# Altium project ThunderGuppy_3.0.PrjPcb (part 1 of 2)
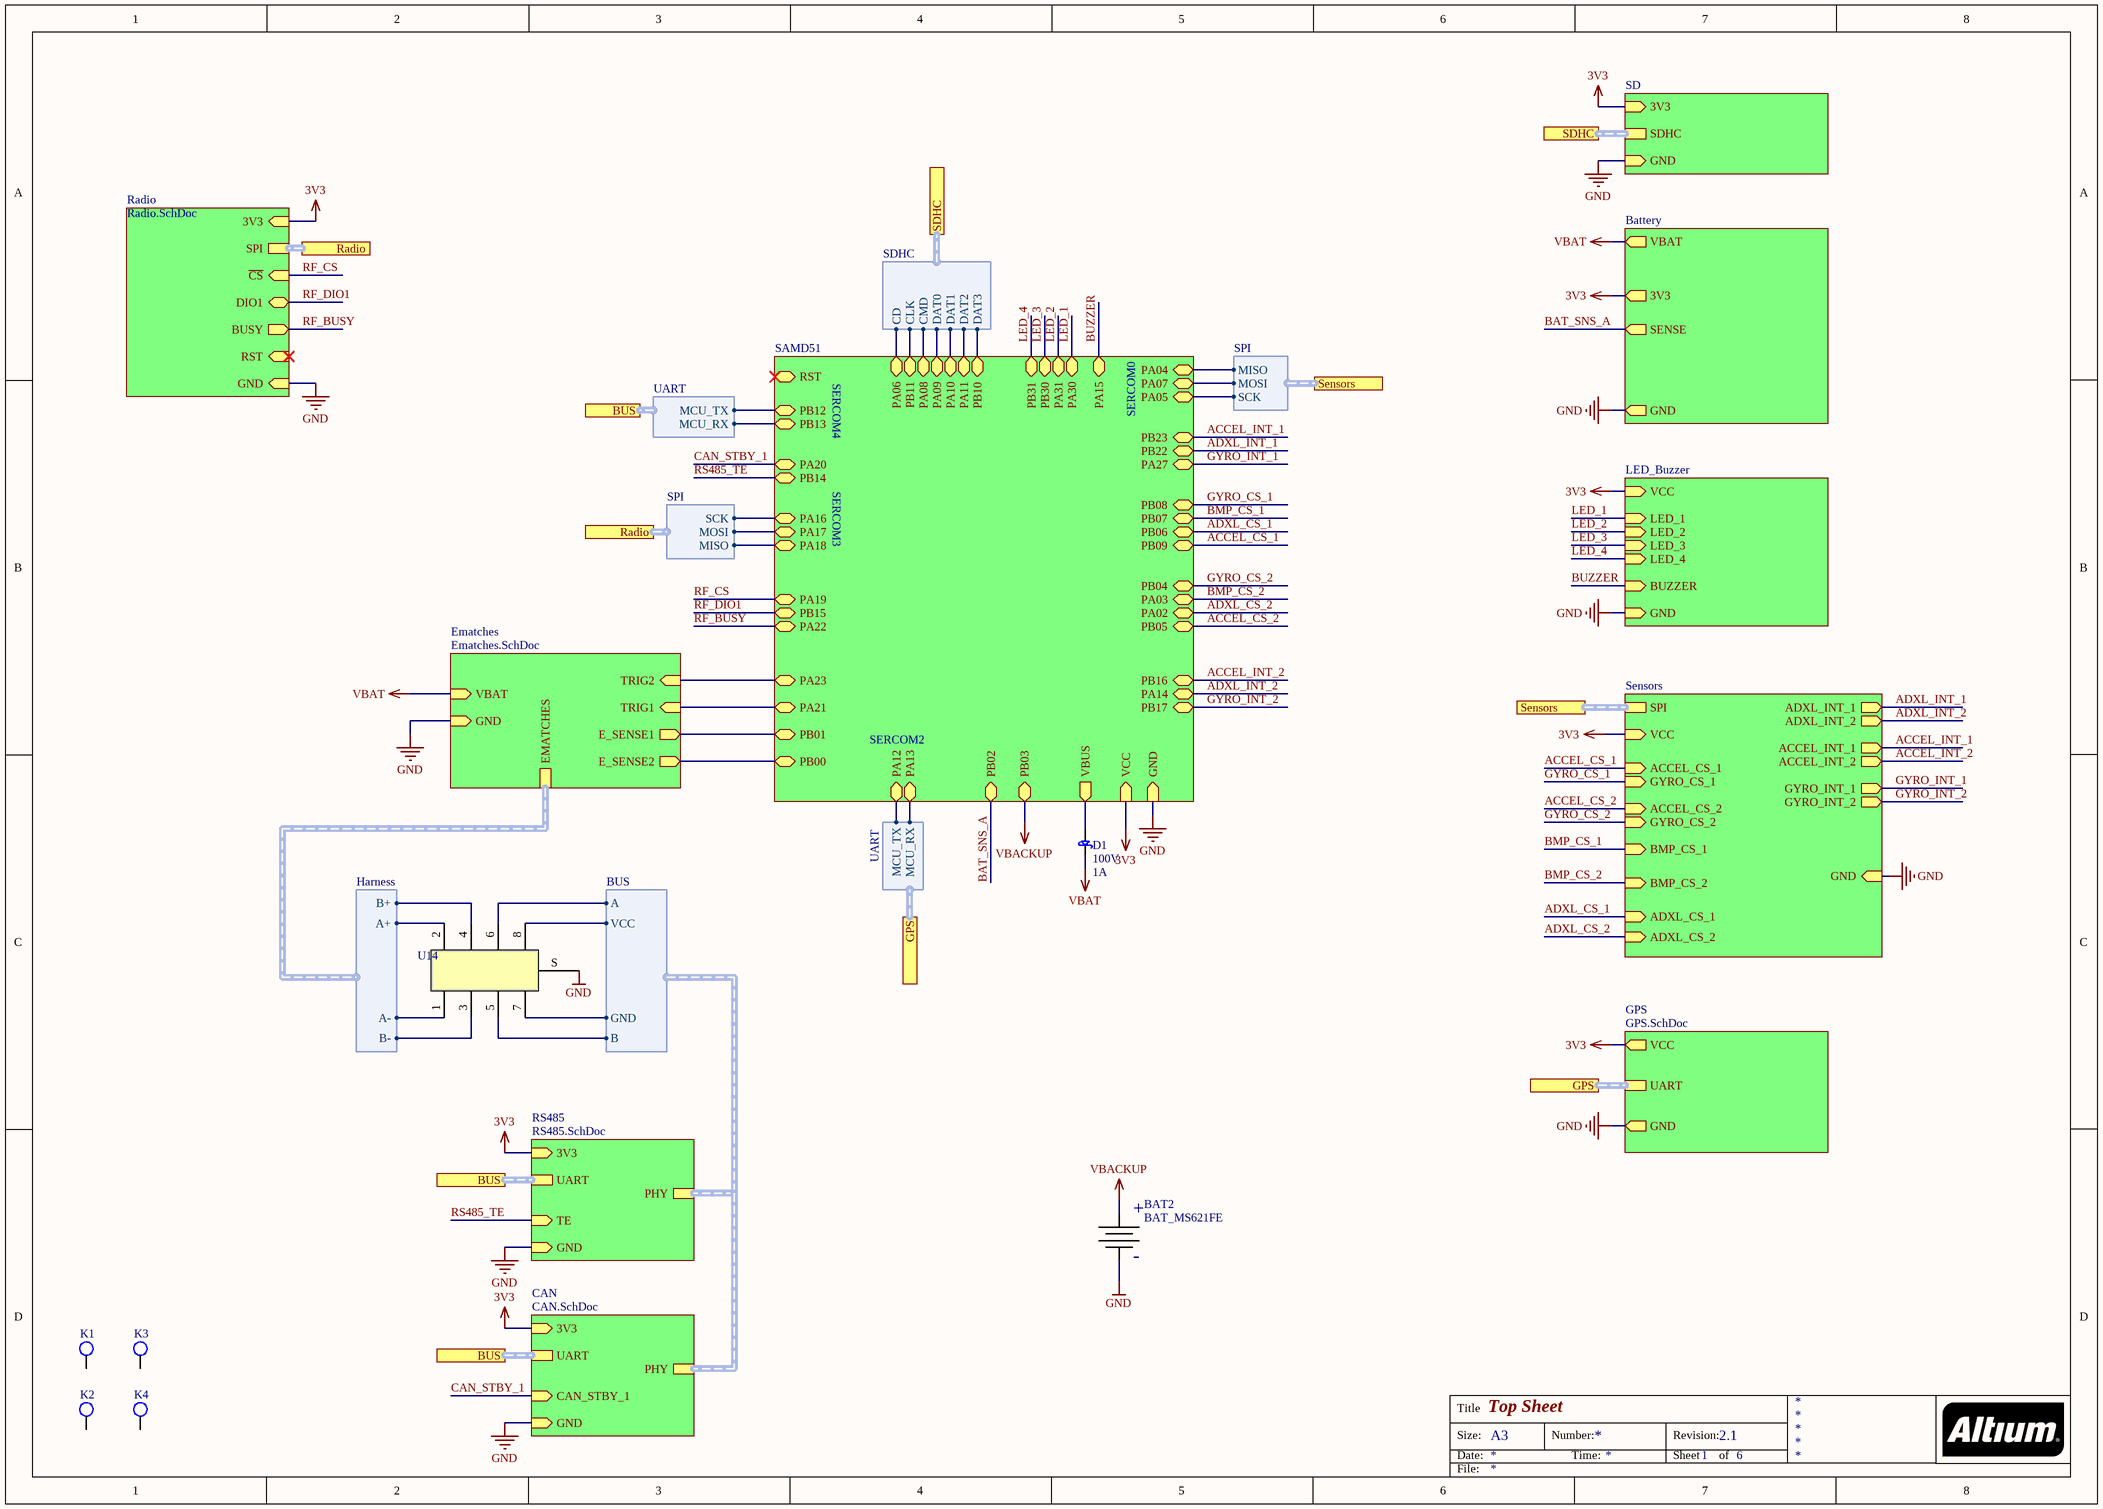
[diagram p0: Guppy.SchDoc]
prjTitle: ThunderGuppy; prjRevision: 1; prjReviewDate: 2019-08-03; prjEngineer1: Tim Vrakas
11 sheets, 114 parts. Net scope: strictly hierarchical (ports join the sheet entries above them; power ports are local).
Board file: Guppy.PcbDoc
Sheets:
  Guppy.SchDoc
    Sensors = Sensors.SchDoc
    Battery = Battery_Management.SchDoc
    LED_Buzzer = Blink_Blink_Beep_Boop.SchDoc
    SAMD51 = SAMD51.SchDoc
    SD = SD.SchDoc
    GPS = GPS.SchDoc
    Ematches = Ematches.SchDoc
    RS485 = RS485.SchDoc
    CAN = CAN.SchDoc
    Radio = Radio.SchDoc

## Sheet Guppy.SchDoc: Top Sheet
size A3; Author: Tim Vrakas; CompanyName: SSI; Revision: 2.1; SheetNumber: 1; SheetTotal: 6; DocumentName: Top Sheet

### Parts
BAT2  BAT_MS621FE  [BATT_COINCELL_RECHARGEABLE]
D1  Voltage - DC Reverse (Vr) (Max): 100V  Current - Average Rectified (Io): 1A  [SMA]  (hidden comment: Diode_CD214A-B1100LF)
K1  #4_PRESSFIT_MOUNTING_FOOT  [#4_PRESSFIT_FOOT_1/4]  (value not drawn)
K2  #4_PRESSFIT_MOUNTING_FOOT  [#4_PRESSFIT_FOOT_1/4]  (value not drawn)
K3  #4_PRESSFIT_MOUNTING_FOOT  [#4_PRESSFIT_FOOT_1/4]  (value not drawn)
K4  #4_PRESSFIT_MOUNTING_FOOT  [#4_PRESSFIT_FOOT_1/4]  (value not drawn)
U14  CONN 2x4 HARWIN M80-5S20805MD  [M80-5S20805MD]  (value not drawn)

### Sub-sheets
Battery = Battery_Management: SENSE (out), GND (out), 3V3 (out), VBAT (out)
CAN = CAN.SchDoc: 3V3 (in), GND (in), UART (harness UART), CAN_STBY_1 (in), PHY (harness BUS)
Ematches = Ematches.SchDoc: E_SENSE1 (out), E_SENSE2 (out), TRIG2 (in), TRIG1 (in), VBAT (in), GND (in), EMATCHES (harness Harness)
GPS = GPS.SchDoc: UART (harness UART), VCC (out), GND (out)
LED_Buzzer = Blink_Blink_Beep_Boop: LED_1 (in), LED_2 (in), LED_3 (in), LED_4 (in), BUZZER (in), GND (in), VCC (in)
Radio = Radio.SchDoc: RST (in), SPI (harness SPI), ~{CS} (in), DIO1 (bidir), BUSY (out), 3V3 (in), GND (in)
RS485 = RS485.SchDoc: 3V3 (in), GND (in), UART (harness UART), TE (in), PHY (harness BUS)
SAMD51 = SAMD51.SchDoc: PA12 (bidir), PA13 (bidir), PA05 (bidir), PA07 (bidir), PA04 (bidir), PA06 (bidir), PB11 (bidir), PA08 (bidir), PA09 (bidir), PA10 (bidir), PA11 (bidir), PB10 (bidir), PB12 (bidir), PB13 (bidir), PA22 (bidir), PA23 (bidir), PA19 (bidir), PA17 (bidir), PA20 (bidir), PA21 (bidir), PB08 (bidir), PB07 (bidir), PB06 (bidir), PB09 (bidir), PB04 (bidir), PA03 (bidir), PA02 (bidir), PB05 (bidir), PB00 (bidir), PB30 (bidir), PA31 (bidir), PA30 (bidir), PB31 (bidir), PB16 (bidir), PA14 (bidir), PB17 (bidir), PB23 (bidir), PB22 (bidir), PA27 (bidir), PB02 (bidir), PB01 (bidir), PB03 (bidir), PA18 (bidir), GND (in), VCC (in), VBUS (out), PB14 (bidir), PB15 (bidir), PA15 (bidir), RST (bidir), PA16 (bidir)
SD = SD.SchDoc: SDHC (harness SDHC), GND (in), 3V3 (in)
Sensors = Sensors.SchDoc: SPI (harness SPI), GYRO_CS_1 (in), BMP_CS_1 (in), ADXL_CS_1 (in), ACCEL_CS_1 (in), ACCEL_INT_1 (out), ACCEL_INT_2 (out), ADXL_INT_1 (out), GYRO_INT_1 (out), GYRO_INT_2 (out), GND (in), VCC (in), GYRO_CS_2 (in), ACCEL_CS_2 (in), BMP_CS_2 (in), ADXL_CS_2 (in), ADXL_INT_2 (out)

### Ports
BUS (harness UART), GPS (harness UART), Radio (harness SPI), SDHC (harness SDHC), Sensors (harness SPI)

### Harnesses
UART: MCU_TX, MCU_RX
SPI: MISO, MOSI, SCK
SDHC: CD, CLK, CMD, DAT0, DAT1, DAT2, DAT3
Harness: A+, A-, B+, B-
BUS: VCC, A, B, GND
UART: MCU_RX, MCU_TX

### Nets
3V3: U14.8 ; sheet Sensors/VCC, sheet Battery/3V3, sheet LED_Buzzer/VCC, sheet SAMD51/VCC, sheet SD/3V3, sheet GPS/VCC, sheet RS485/3V3, sheet CAN/3V3, sheet Radio/3V3, sheet RS485/PHY.VCC
GND: BAT2.- U14.7 U14.S ; sheet Sensors/GND, sheet Battery/GND, sheet LED_Buzzer/GND, sheet SAMD51/GND, sheet SD/GND, sheet GPS/GND, sheet Ematches/GND, sheet RS485/GND, sheet CAN/GND, sheet Radio/GND, sheet RS485/PHY.GND
VBACKUP: BAT2.+ ; sheet SAMD51/PB03
VBAT: D1.2(Cathode) U14.2 U14.4 ; sheet Battery/VBAT, sheet Ematches/VBAT, sheet Ematches/EMATCHES.A+, sheet Ematches/EMATCHES.B+
VBUS: D1.1(Anode) ; sheet SAMD51/VBUS
ACCEL_CS_1: sheet Sensors/ACCEL_CS_1, sheet SAMD51/PB09
ACCEL_CS_2: sheet Sensors/ACCEL_CS_2, sheet SAMD51/PB05
ACCEL_INT_1: sheet Sensors/ACCEL_INT_1, sheet SAMD51/PB23
ACCEL_INT_2: sheet Sensors/ACCEL_INT_2, sheet SAMD51/PB16
ADXL_CS_1: sheet Sensors/ADXL_CS_1, sheet SAMD51/PB06
ADXL_CS_2: sheet Sensors/ADXL_CS_2, sheet SAMD51/PA02
ADXL_INT_1: sheet Sensors/ADXL_INT_1, sheet SAMD51/PB22
ADXL_INT_2: sheet Sensors/ADXL_INT_2, sheet SAMD51/PA14
BAT_SNS_A: sheet Battery/SENSE, sheet SAMD51/PB02
BMP_CS_1: sheet Sensors/BMP_CS_1, sheet SAMD51/PB07
BMP_CS_2: sheet Sensors/BMP_CS_2, sheet SAMD51/PA03
BUZZER: sheet LED_Buzzer/BUZZER, sheet SAMD51/PA15
CAN_STBY_1: sheet SAMD51/PA20, sheet CAN/CAN_STBY_1
GYRO_CS_1: sheet Sensors/GYRO_CS_1, sheet SAMD51/PB08
GYRO_CS_2: sheet Sensors/GYRO_CS_2, sheet SAMD51/PB04
GYRO_INT_1: sheet Sensors/GYRO_INT_1, sheet SAMD51/PA27
GYRO_INT_2: sheet Sensors/GYRO_INT_2, sheet SAMD51/PB17
LED_1: sheet LED_Buzzer/LED_1, sheet SAMD51/PA30
LED_2: sheet LED_Buzzer/LED_2, sheet SAMD51/PA31
LED_3: sheet LED_Buzzer/LED_3, sheet SAMD51/PB30
LED_4: sheet LED_Buzzer/LED_4, sheet SAMD51/PB31
MISO: sheet SAMD51/PA04, port Sensors.MISO
MOSI: sheet SAMD51/PA07, port Sensors.MOSI
RF_BUSY: sheet SAMD51/PA22, sheet Radio/BUSY
RF_CS: sheet SAMD51/PA19, sheet Radio/~{CS}
RF_DIO1: sheet SAMD51/PB15, sheet Radio/DIO1
RS485_TE: sheet SAMD51/PB14, sheet RS485/TE
SCK: sheet SAMD51/PA05, port Sensors.SCK
SD_CD: sheet SAMD51/PA06, port SDHC.CD
SD_CLK: sheet SAMD51/PB11, port SDHC.CLK
SD_CMD: sheet SAMD51/PA08, port SDHC.CMD
SD_DAT0: sheet SAMD51/PA09, port SDHC.DAT0
SD_DAT1: sheet SAMD51/PA10, port SDHC.DAT1
SD_DAT2: sheet SAMD51/PA11, port SDHC.DAT2
SD_DAT3: sheet SAMD51/PB10, port SDHC.DAT3
SELF_BUS_H: U14.6 ; sheet RS485/PHY.A
SELF_BUS_L: U14.5 ; sheet RS485/PHY.B
NetCANA1_1: sheet SAMD51/PB13, port BUS.MCU_RX
NetCANA1_4: sheet SAMD51/PB12, port BUS.MCU_TX
NetQ1_5: U14.3 ; sheet Ematches/EMATCHES.B-
NetQ1_7: U14.1 ; sheet Ematches/EMATCHES.A-
NetR5_2: sheet SAMD51/PB01, sheet Ematches/E_SENSE1
NetR6_1: sheet SAMD51/PA21, sheet Ematches/TRIG1
NetR9_2: sheet SAMD51/PB00, sheet Ematches/E_SENSE2
NetR10_1: sheet SAMD51/PA23, sheet Ematches/TRIG2
NetU10_13: sheet SAMD51/PA13, port GPS.MCU_RX
NetU10_14: sheet SAMD51/PA12, port GPS.MCU_TX
NetU12_35: sheet SAMD51/PA16, port Radio.SCK
NetU12_36: sheet SAMD51/PA17, port Radio.MOSI
NetU12_37: sheet SAMD51/PA18, port Radio.MISO

Not connected (* = marked no-connect by the designer): K1 1; K2 1; K3 1; K4 1

### Buses and harness runs
harness port BUS = sheet CAN/UART
harness port BUS = sheet RS485/UART
harness port GPS = sheet GPS/UART
harness port Radio = sheet Radio/SPI
harness port SDHC = sheet SD/SDHC
harness port Sensors = sheet Sensors/SPI
harness sheet CAN/PHY = sheet RS485/PHY

### Notes on the sheet
- SERCOM4
- SERCOM0
- SERCOM3
- SERCOM2
- Title
- Size:
- Date:
- A3
- Number:
- Time:
- Revision:
- Sheet
- of
- File:

### Library data of the parts
BAT2 = CMP-060-0000-1: MS621FE RECHARGEABLE COIN CELL BACKUP; Manufacturer: Seiko Instruments; Manufacturer Part Number: MS621FE-FL11E; Battery Chemistry: Lithium; Battery Cell Size: Coin, 6.8mm; Capacity: 5.5mAh; Discharge Rate: 15µA; Shipping Info: Due to restrictions, only ground shipment is allowed.; RoHS: RoHS Compliant; Stock 1: 41059; Pricing 1: 1=2.04, 10=1.838, 50=1.6338, 100=1.4296, 250=1.30704, 500=1.22534, 1000=1.09051, 2500=1.0112, 5000=0.99138 (USD); Part Status: Active; Size / Dimension: 0.27" Dia x 0.08" H (6.8mm x 2.1mm); Termination Style: SMD (SMT) Tab; Standard Charge Current: 15µA; Standard Charge Time: -; Weight: 0.23g; ComponentLink1URL: http://www.sii.co.jp/en/me/files/2017/04/MicroBatteryCatalogue-E_2017_web.pdf; ComponentLink1Description: http://www.sii.co.jp/en/me/files/2017/04/MicroBatteryCatalogue-E_2017_web.pdf; Design Item ID: BAT_MS621FE; Source: miscellaneous.SchLib
D1 = CMP-033-0060-1: Diode Schottky 100V 1A Surface Mount SMA (DO-214AC); Manufacturer: Bourns Inc.; Voltage - Forward (Vf) (Max) @ If: 790mV @ 1A; Current - Reverse Leakage @ Vr: 500µA @ 100V; Speed: Fast Recovery =< 500ns, > 200mA (Io); Capacitance @ Vr, F: 30pF @ 4V, 1MHz; Design Item ID: Diode_CD214A-B1100LF; Part Status: Active; Source: diode.SchLib; Stock 1: 21982; Manufacturer Part Number: CD214A-B1100LF; Diode Type: Schottky; Reverse Recovery Time (trr): -; Operating Temperature - Junction: -55°C ~ 125°C; RoHS: RoHS Compliant; Supplier Device Package: SMA (DO-214AC); Package / Case: DO-214AC, SMA; Packaging: Cut Tape (CT); ComponentLink1Description: http://www.bourns.com/docs/Product-Datasheets/CD214-B120_B1100.pdf; Mounting Type: Surface Mount; Pricing 1: 1=0.54, 10=0.42, 25=0.3544, 100=0.2888, 250=0.2392, 500=0.1976, 1000=0.148, 2500=0.136 (USD); ComponentLink1URL: http://www.bourns.com/docs/Product-Datasheets/CD214-B120_B1100.pdf
K1-K4 = CMP-054-0013-1: Press-Fit Unthreaded Spacers, 7/32" OD, 1/8" Long; Supplier Link: https://www.mcmaster.com/#92985a610/=16cb2ec; Design Item ID: #4_PRESSFIT_MOUNTING_FOOT; Source: mechanical.SchLib
U14 = CMP-030-0082-1: Design Item ID: CONN 2x4 HARWIN M80-5S20805MD; Source: connector.SchLib

## Sheet Sensors.SchDoc
size A3
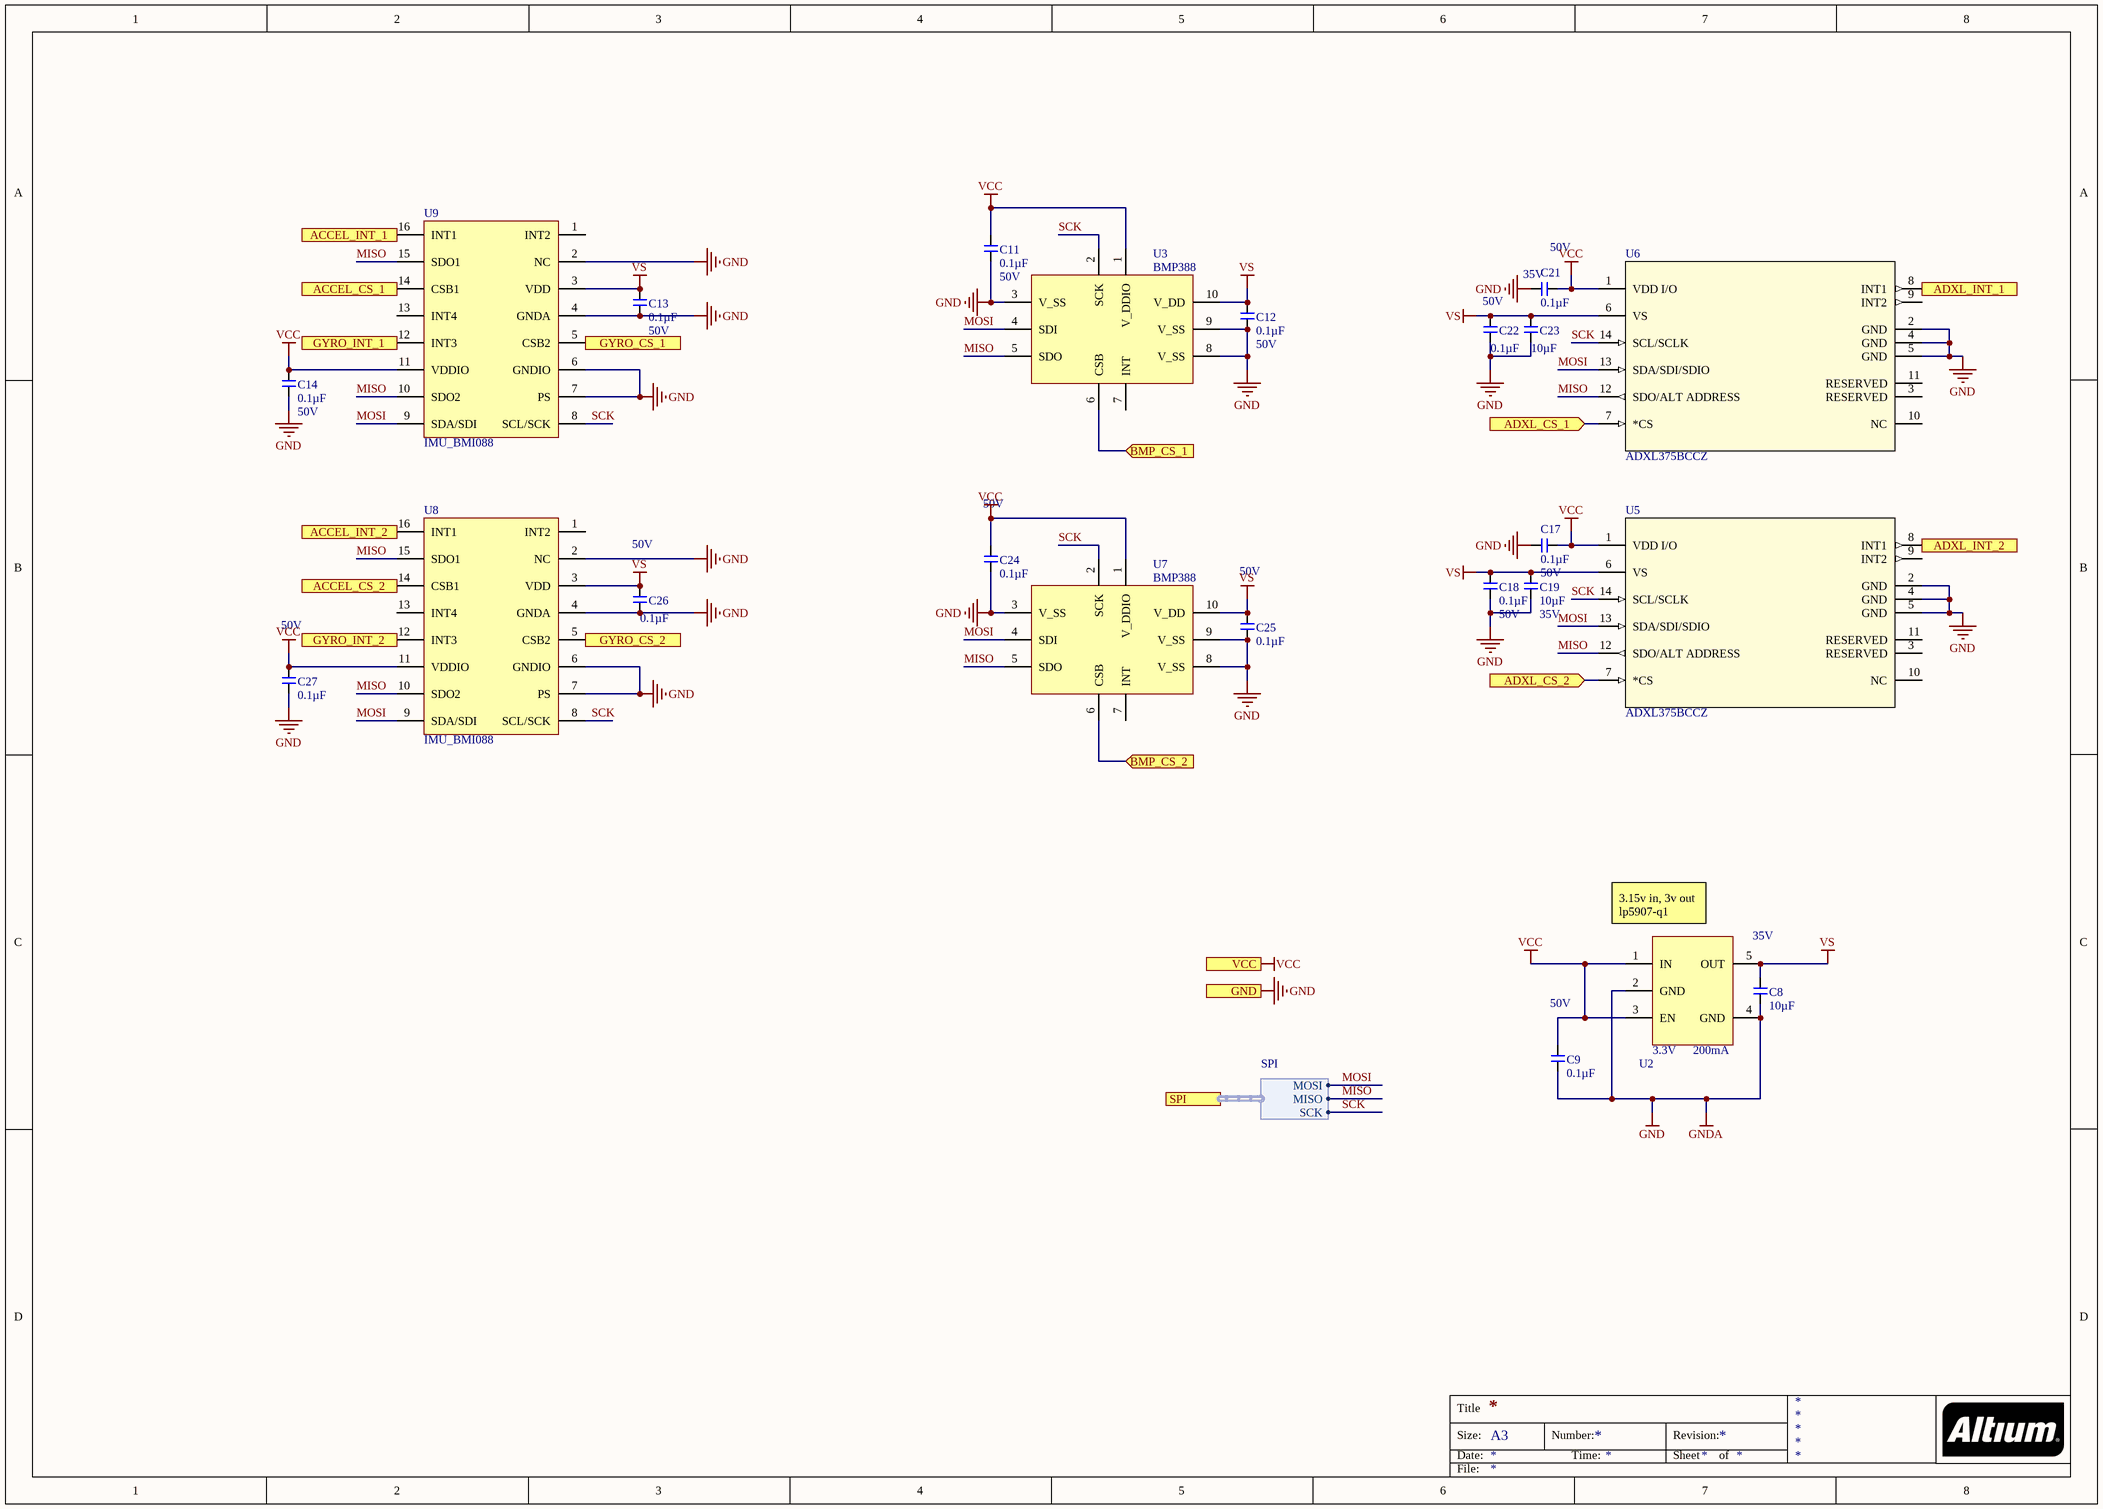
[diagram p1: Sensors.SchDoc]

### Parts
C8  Capacitance (shorthand): 10µF  Rated Voltage: 35V  [C0603]  (hidden comment: 490-13248-1-ND)
C9  Capacitance (shorthand): 0.1µF  Rated Voltage: 50V  [C0603]  (hidden comment: 490-1519-1-ND)
C11  Capacitance (shorthand): 0.1µF  Rated Voltage: 50V  [C0603]  (hidden comment: 490-1519-1-ND)
C12  Capacitance (shorthand): 0.1µF  Rated Voltage: 50V  [C0603]  (hidden comment: 490-1519-1-ND)
C13  Capacitance (shorthand): 0.1µF  Rated Voltage: 50V  [C0603]  (hidden comment: 490-1519-1-ND)
C14  Capacitance (shorthand): 0.1µF  Rated Voltage: 50V  [C0603]  (hidden comment: 490-1519-1-ND)
C17  Capacitance (shorthand): 0.1µF  Rated Voltage: 50V  [C0603]  (hidden comment: 490-1519-1-ND)
C18  Capacitance (shorthand): 0.1µF  Rated Voltage: 50V  [C0603]  (hidden comment: 490-1519-1-ND)
C19  Capacitance (shorthand): 10µF  Rated Voltage: 35V  [C0603]  (hidden comment: 490-13248-1-ND)
C21  Capacitance (shorthand): 0.1µF  Rated Voltage: 50V  [C0603]  (hidden comment: 490-1519-1-ND)
C22  Capacitance (shorthand): 0.1µF  Rated Voltage: 50V  [C0603]  (hidden comment: 490-1519-1-ND)
C23  Capacitance (shorthand): 10µF  Rated Voltage: 35V  [C0603]  (hidden comment: 490-13248-1-ND)
C24  Capacitance (shorthand): 0.1µF  Rated Voltage: 50V  [C0603]  (hidden comment: 490-1519-1-ND)
C25  Capacitance (shorthand): 0.1µF  Rated Voltage: 50V  [C0603]  (hidden comment: 490-1519-1-ND)
C26  Capacitance (shorthand): 0.1µF  Rated Voltage: 50V  [C0603]  (hidden comment: 490-1519-1-ND)
C27  Capacitance (shorthand): 0.1µF  Rated Voltage: 50V  [C0603]  (hidden comment: 490-1519-1-ND)
U2  Voltage - Output: 3.3V  Current - Output: 200mA  [5SOT23]  (hidden comment: LDO_TLV70033QDDCRQ1)
U3  BMP388  [8 pin LGA]
U5  ADXL375BCCZ  [LGA_CC-14-1]
U6  ADXL375BCCZ  [LGA_CC-14-1]
U7  BMP388  [8 pin LGA]
U8  IMU_BMI088  [BMI088]
U9  IMU_BMI088  [BMI088]

### Ports
ACCEL_CS_1 (in), ACCEL_CS_2 (in), ACCEL_INT_1 (out), ACCEL_INT_2 (out), ADXL_CS_1 (in), ADXL_CS_2 (in), ADXL_INT_1 (out), ADXL_INT_2 (out), BMP_CS_1 (in), BMP_CS_2 (in), GND (in), GYRO_CS_1 (in), GYRO_CS_2 (in), GYRO_INT_1 (out), GYRO_INT_2 (out), SPI (harness SPI), VCC (in)

### Harnesses
SPI: MISO, MOSI, SCK

### Nets
GND: C8.2 C9.2 C11.2 C12.2 C13.2 C14.2 C17.2 C18.1 C19.2 C21.2 C22.1 C23.2 C24.2 C25.2 C26.2 C27.2 U2.2(GND) U2.4(GND) U3.3(V_SS) U3.8(V_SS) U3.9(V_SS) U5.2(GND) U5.4(GND) U5.5(GND) U6.2(GND) U6.4(GND) U6.5(GND) U7.3(V_SS) U7.8(V_SS) U7.9(V_SS) U8.2(NC) U8.4(GNDA) U8.6(GNDIO) U8.7(PS) U9.2(NC) U9.4(GNDA) U9.6(GNDIO) U9.7(PS) ; port GND  [also labelled GNDA]
VCC: C9.1 C11.1 C14.1 C17.1 C21.1 C24.1 C27.1 U2.1(IN) U2.3(EN) U3.1(V_DDIO) U5.1(VDD_I/O) U6.1(VDD_I/O) U7.1(V_DDIO) U8.11(VDDIO) U9.11(VDDIO) ; port VCC  [project net 3V3]
VS: C8.1 C12.1 C13.1 C18.2 C19.1 C22.2 C23.1 C25.1 C26.1 U2.5(OUT) U3.10(V_DD) U5.6(VS) U6.6(VS) U7.10(V_DD) U8.3(VDD) U9.3(VDD)
ACCEL_CS_1: U9.14(CSB1) ; port ACCEL_CS_1
ACCEL_CS_2: U8.14(CSB1) ; port ACCEL_CS_2
ACCEL_INT_1: U9.16(INT1) ; port ACCEL_INT_1
ACCEL_INT_2: U8.16(INT1) ; port ACCEL_INT_2
ADXL_CS_1: U6.7(*CS) ; port ADXL_CS_1
ADXL_CS_2: U5.7(*CS) ; port ADXL_CS_2
ADXL_INT_1: U6.8(INT1) ; port ADXL_INT_1
ADXL_INT_2: U5.8(INT1) ; port ADXL_INT_2
BMP_CS_1: U3.6(CSB) ; port BMP_CS_1
BMP_CS_2: U7.6(CSB) ; port BMP_CS_2
GYRO_CS_1: U9.5(CSB2) ; port GYRO_CS_1
GYRO_CS_2: U8.5(CSB2) ; port GYRO_CS_2
GYRO_INT_1: U9.12(INT3) ; port GYRO_INT_1
GYRO_INT_2: U8.12(INT3) ; port GYRO_INT_2
MISO: U3.5(SDO) U5.12(SDO/ALT_ADDRESS) U6.12(SDO/ALT_ADDRESS) U7.5(SDO) U8.10(SDO2) U8.15(SDO1) U9.10(SDO2) U9.15(SDO1) ; port SPI.MISO
MOSI: U3.4(SDI) U5.13(SDA/SDI/SDIO) U6.13(SDA/SDI/SDIO) U7.4(SDI) U8.9(SDA/SDI) U9.9(SDA/SDI) ; port SPI.MOSI
SCK: U3.2(SCK) U5.14(SCL/SCLK) U6.14(SCL/SCLK) U7.2(SCK) U8.8(SCL/SCK) U9.8(SCL/SCK) ; port SPI.SCK

Not connected (* = marked no-connect by the designer): U3 7(INT); U5 3(RESERVED) 9(INT2) 10(NC) 11(RESERVED); U6 3(RESERVED) 9(INT2) 10(NC) 11(RESERVED); U7 7(INT); U8 1(INT2) 13(INT4); U9 1(INT2) 13(INT4)

### Notes on the sheet
- (near U2) 3.15v in, 3v out
  lp5907-q1
- Title
- Size:
- Date:
- A3
- Number:
- Time:
- Revision:
- Sheet
- of
- File:

### Library data of the parts
C8 C19 C23 = CMP-119-0071-1: CAP CER 10UF 35V X5R 0603 20%; Manufacturer: Murata Electronics North America; Capacitance - pF (Machine readable): #NAME?; Dielectric: X5R
C9 C11-C14 C17 C18 C21 C22 C24-C27 = CMP-119-0065-1: CAP CER 0603 0.1µF X7R 50V 10%; Manufacturer: Murata Electronics North America; Capacitance - pF (Machine readable): #NAME?; Dielectric: X7R
U2 = CMP-048-0071-1: IC REG LDO 3.3V .2A SOT23-5; Manufacturer: Texas Instruments; Number of Regulators: 1; Regulator Topology: Positive Fixed; Current - Limit (Min): 220mA; Voltage - Input: Up to 5.5V; Manufacturer Part Number: TLV70033QDDCRQ1; Stock 1: 889; Pricing 1: 1=0.58, 10=0.507, 25=0.444, 100=0.1661, 250=0.16296, 500=0.1599, 750=0.15683 (USD); RoHS: RoHS Compliant; Packaging: Cut Tape (CT); ComponentLink1URL: http://www.ti.com/lit/ds/symlink/tlv70033-q1.pdf; ComponentLink1Description: Datasheet; Voltage - Dropout (Typical): -; Operating Temperature: -40°C ~ 125°C; Mounting Type: Surface Mount; Package / Case: SOT-23-5 Thin, TSOT-23-5; Supplier Device Package: SOT-5; Design Item ID: LDO_TLV70033QDDCRQ1; Source: ic_pmic.SchLib
U3 U7 = CMP-074-0001-1: SENSOR PRESSURE ABS; Manufacturer: Bosch Sensortec; Manufacturer Part Number: BMP388; Stock 1: 46050; Pricing 1: 1=3.93, 5=3.466, 10=3.061, 25=2.4832, 50=2.1946, 100=2.1368, 500=1.7903, 1000=1.6748, 5000=1.5593 (USD); ComponentLink1URL: https://ae-bst.resource.bosch.com/media/_tech/media/product_flyer/BST-BMP388-FL000-00.pdf; ComponentLink1Description: https://ae-bst.resource.bosch.com/media/_tech/media/product_flyer/BST-BMP388-FL000-00.pdf; Design Item ID: BMP388; Source: sensor.SchLib
U5 U6 = CMP-074-0018-1: 200G Accelcerometer; Manufacturer: Analog Devices; Manufacturer Part Number: ADXL375BCCZ-RL7; Bandwidth: 1kHz; Interface: I2C,SPI; Nominal Supply Current: 145uA; -3db Bandwidth: 1.6kHz; Output Type: Digital; Axis: X, Y, Z; Sensitivity: 20.5LSB/g; Operating Supply Voltage: 3.6V; Stock 1: 3410; Pricing 1: 1=10.9, 10=10.021, 100=8.463, 500=7.5284 (USD); Mount: Surface Mount; Number of Pins: 14; Min Operating Temperature: -40°C; Max Operating Temperature: 85°C; Package Quantity: 1; Operating Supply Current: 145uA; Lead Free: Contains Lead; Design Item ID: ADXL375BCCZ; Source: sensor.SchLib
U8 U9 = CMP-074-0017-1: Bosch BMI088; Design Item ID: IMU_BMI088; Source: sensor.SchLib

## Sheet Battery_Management.SchDoc: Battery Management
size A3; SheetNumber: 4; SheetTotal: 6
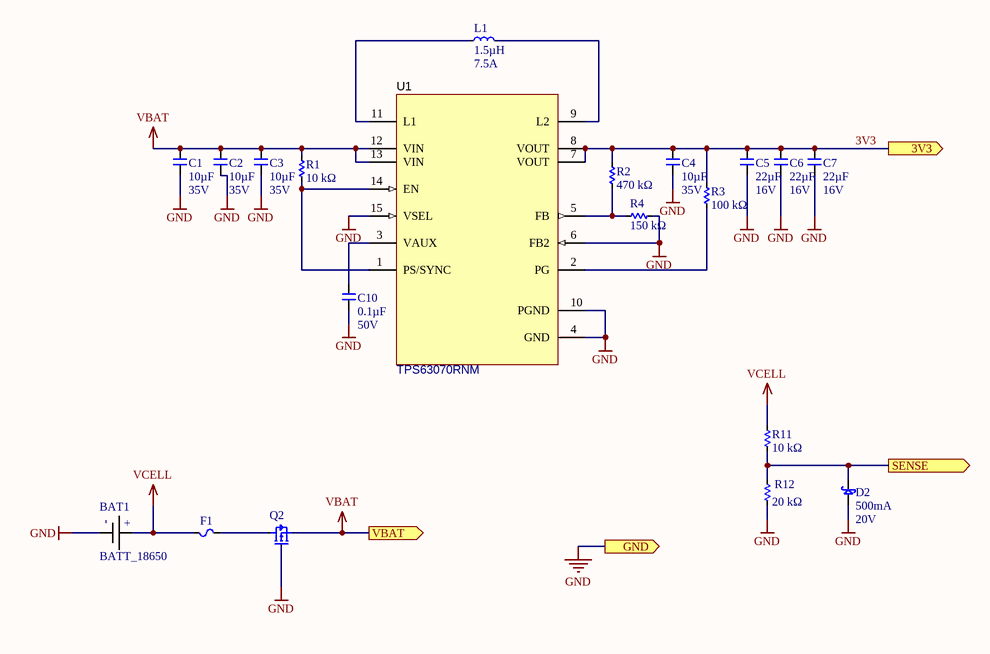
[diagram p2: Battery_Management.SchDoc]

### Parts
BAT1  BATT_18650  [BATT_18650_KEYSTONE_1042_VIAS]
C1  Capacitance (shorthand): 10µF  Rated Voltage: 35V  [C0603]  (hidden comment: 490-13248-1-ND)
C2  Capacitance (shorthand): 10µF  Rated Voltage: 35V  [C0603]  (hidden comment: 490-13248-1-ND)
C3  Capacitance (shorthand): 10µF  Rated Voltage: 35V  [C0603]  (hidden comment: 490-13248-1-ND)
C4  Capacitance (shorthand): 10µF  Rated Voltage: 35V  [C0603]  (hidden comment: 490-13248-1-ND)
C5  Capacitance (shorthand): 22µF  Rated Voltage: 16V  [C0603]  (hidden comment: 1276-7076-1-ND)
C6  Capacitance (shorthand): 22µF  Rated Voltage: 16V  [C0603]  (hidden comment: 1276-7076-1-ND)
C7  Capacitance (shorthand): 22µF  Rated Voltage: 16V  [C0603]  (hidden comment: 1276-7076-1-ND)
C10  Capacitance (shorthand): 0.1µF  Rated Voltage: 50V  [C0603]  (hidden comment: 490-1519-1-ND)
D2  Current - Average Rectified (Io): 500mA  Voltage - DC Reverse (Vr) (Max): 20V  [SOD123]  (hidden comment: Symbol)
F1  Symbol  [R1206]  (value not drawn)
L1  Inductance: 1.5µH  Current Rating: 7.5A  [SMD5230]  (hidden comment: Symbol)
Q2  PFET_SI7615ADN-T1  [POWERPAK_1212-8_SINGLE]  (value not drawn)
R1  Resistance: 10 kΩ  [R0603]  (hidden comment: 311-10.0KHRCT-ND)
R2  Resistance: 470 kΩ  [R0603]  (hidden comment: 311-470KHRCT-ND)
R3  Resistance: 100 kΩ  [R0603]  (hidden comment: 311-100KHRCT-ND)
R4  Resistance: 150 kΩ  [R0603]  (hidden comment: 311-150KHRCT-ND)
R11  Resistance: 10 kΩ  [R0603]  (hidden comment: 311-10.0KHRCT-ND)
R12  Resistance: 20 kΩ  [R0603]  (hidden comment: 311-20.0KHRCT-ND)
U1  TPS63070RNM  [TPS63070]

### Ports
3V3 (out), GND (out), SENSE (out), VBAT (out)

### Nets
3V3: C4.1 C5.1 C6.1 C7.1 R2.2 R3.2 U1.7(VOUT) U1.8(VOUT) ; port 3V3
GND: BAT1.CELL- C1.2 C2.2 C3.2 C4.2 C5.2 C6.2 C7.2 C10.2 D2.1 Q2.4 R4.2 R12.1 U1.4(GND) U1.6(FB2) U1.10(PGND) U1.15(VSEL) ; port GND
VBAT: C1.1 C2.1 C3.1 Q2.1 R1.2 U1.12(VIN) U1.13(VIN) ; port VBAT
VCELL: BAT1.CELL+ F1.1 R11.2
BAT_SNS_A: D2.2 R11.1 R12.2 ; port SENSE
NetC10_1: C10.1 U1.3(VAUX)
NetF1_2: F1.2 Q2.5
NetL1_1: L1.1 U1.11(L1)
NetL1_2: L1.2 U1.9(L2)
NetR1_1: R1.1 U1.1(PS/SYNC) U1.14(EN)
NetR2_1: R2.1 R4.1 U1.5(FB)
NetR3_1: R3.1 U1.2(PG)

### Notes on the sheet
- Title
- Size:
- Date:
- A3
- Number:
- Time:
- Revision:
- Sheet
- of
- File:
- (in symbol CMP-030-0003-3) +

### Library data of the parts
BAT1 = CMP-030-0003-3: Dual Lithium Ion Cell Holder; Manufacturer: Keystone Electronics; Manufacturer Part Number: 1048P; Battery Type, Function: Cylindrical, Holder; Style: Holder (Open); Battery Cell Size: 18650; Number of Cells: 2; Body Material: Nylon; RoHS: RoHS Compliant; Battery Series: -; Mounting Type: PCB, Surface Mount; Termination Style: SMD (SMT) Tab; Height Above Board: 0.585" (14.86mm); Operating Temperature: -50°C ~ 145°C; ComponentLink1URL: http://www.keyelco.com/product-pdf.cfm?p=13959; ComponentLink1Description: http://www.keyelco.com/product-pdf.cfm?p=13959; Stock 1: 6575; Pricing 1: 1=2.76000, 10=2.32100, 50=2.03840, 250=1.76540, 1000=1.63000, 2500=1.40140, 5000=1.27400 (USD); Mount: Surface Mount; Case/Package: SMD/SMT; Material: Nylon; Contact Plating: Tin; Contact Material: Bronze; Min Operating Temperature: -50°C; Max Operating Temperature: 145°C; Package Quantity: 1; Packaging: Tray; Termination: SMD/SMT; Lead Free: Lead Free; ComponentLink2URL: https://datasheet.ciiva.com/4/1042-4715.pdf?src-supplier=Digi-Key; ComponentLink2Description: https://datasheet.ciiva.com/4/1042-4715.pdf?src-supplier=Digi-Key; ComponentLink3URL: https://datasheet.ciiva.com/3353/key1042-rev-eng-tds-3353207.pdf?src-supplier=Distrelec; ComponentLink3Description: https://datasheet.ciiva.com/3353/key1042-rev-eng-tds-3353207.pdf?src-supplier=Distrelec; Design Item ID: BATT_18650; Source: connector.SchLib
C1-C4 = CMP-119-0071-1: as C8 on sheet Sensors; Dielectric: X5R
C5-C7 = CMP-119-0072-1: CAP CER 22UF 16V X5R 0603 20%; Manufacturer: Samsung Electro-Mechanics; Capacitance - pF (Machine readable): #NAME?; Dielectric: X5R
C10 = CMP-119-0065-1: as C9 on sheet Sensors; Dielectric: X7R
D2 = CMP-033-0037-1: DIODE SCHOTTKY 0.5A 20V SOD-123; Manufacturer: Fairchild Semiconductor; Manufacturer Part Number: MBR0520L; Speed: Fast Recovery =< 500ns, > 200mA (Io); Current - Reverse Leakage @ Vr: 250µA @ 20V; Voltage - Forward (Vf) (Max) @ If: 385mV @ 500mA; RoHS: RoHS Compliant; Stock 1: 217232; Pricing 1: 1=0.63, 10=0.43, 100=0.2024, 250=0.1442, 500=0.11006, 750=0.08603, 1000=0.0759 (USD); Diode Type: Schottky; Reverse Recovery Time (trr): -; Capacitance @ Vr, F: -; Mounting Type: Surface Mount; Package / Case: SOD-123; Supplier Device Package: SOD-123; Packaging: Cut Tape (CT); ComponentLink1URL: http://www.fairchildsemi.com/ds/MB/MBR0520L.pdf; ComponentLink1Description: Datasheet; Design Item ID: SCHOTTKY_MBR0520L; Source: diode.SchLib
F1 = CMP-035-0003-1: Design Item ID: __template_fuse; Source: fuse.SchLib
L1 = CMP-052-0036-1: INDUCTOR POWER 1.5UH 7.5A SMD; Manufacturer: Vishay Dale; Manufacturer Part Number: IHLP2020CZER1R5M11; Current - Saturation: 7A; Tolerance: ±20%; Shielding: Shielded; DC Resistance (DCR): 18.5 mOhm Max; Frequency - Test: 100kHz; RoHS: RoHS Compliant; Stock 1: 17936; Pricing 1: 1=2.29, 10=1.86, 100=1.55, 500=1.24, 1000=1.116 (USD); Material - Core: -; Q @ Freq: -; Frequency - Self Resonant: -; Operating Temperature: -55°C ~ 125°C; Package / Case: Non Standard; Size / Dimension: 0.216" L x 0.204" W x 0.118" H (5.49mm x 5.18mm x 3.00mm); Mounting Type: Surface Mount; Packaging: Cut Tape (CT); ComponentLink1URL: http://www.vishay.com/docs/34260/lp20cz11.pdf; ComponentLink1Description: Datasheet; Design Item ID: IND_IHLP2020CZER1R5M11; Source: inductor.SchLib
Q2 = CMP-078-0043-2: MOSFET P-CH 20V 35A PPK; Manufacturer Part Number: SI7615ADN-T1-GE3; Manufacturer: Vishay Siliconix; Power - Max: 52W; FET Feature: Standard; FET Type: MOSFET P-Channel, Metal Oxide; Rds On (Max) @ Id, Vgs: 4.4 mOhm @ 20A, 10V; Input Capacitance (Ciss) @ Vds: 5590pF @ 10V; Current - Continuous Drain (Id) @ 25°C: 35A (Tc); Vgs(th) (Max) @ Id: 1.5V @ 250µA; Gate Charge (Qg) @ Vgs: 183nC @ 10V; Source: transistor_fet.SchLib; Supplier Device Package: PowerPAK® 1212-8; Drain to Source Voltage (Vdss): 20V; Design Item ID: PFET_SI7615ADN-T1; Stock 1: 98451; Operating Temperature: -55°C ~ 150°C (TJ); RoHS: RoHS Compliant; Pricing 1: 1=0.73, 10=0.646, 25=0.6068, 100=0.4951, 250=0.45988, 500=0.3914, 1000=0.31312 (USD); Mounting Type: Surface Mount; Packaging: Cut Tape (CT); ComponentLink1URL: http://www.vishay.com/docs/62667/si7615adn.pdf; Package / Case: PowerPAK® 1212-8; ComponentLink1Description: http://www.vishay.com/docs/62667/si7615adn.pdf; Part Status: Active
R1 R11 = CMP-126-0273-1: RES SMD 10K OHM 1% 1/10W 0603; Manufacturer Part Number: RC0603FR-0710KL; Manufacturer: Yageo; Resistance (Sortable): 10000; Power (Watts): 0.1W, 1/10W; Temperature Coefficient: ±100ppm/°C; Datasheets: http://www.yageo.com/documents/recent/PYu-RC_Group_51_RoHS_L_9.pdf; Image: //media.digikey.com/Renders/Yageo%20Renders/0603-(1608-Metric).jpg; Tolerance: ±1%; Operating Temperature: -55°C ~ 155°C
R2 = CMP-126-0450-1: RES SMD 470K OHM 1% 1/10W 0603; Manufacturer Part Number: RC0603FR-07470KL; Manufacturer: Yageo; Power (Watts): 0.1W, 1/10W; Resistance (Sortable): 470000; Temperature Coefficient: ±100ppm/°C; Tolerance: ±1%; Datasheets: http://www.yageo.com/documents/recent/PYu-RC_Group_51_RoHS_L_9.pdf; Image: //media.digikey.com/Renders/Yageo%20Renders/0603-(1608-Metric).jpg; Operating Temperature: -55°C ~ 155°C
R3 = CMP-126-0382-1: RES SMD 100K OHM 1% 1/10W 0603; Manufacturer Part Number: RC0603FR-07100KL; Manufacturer: Yageo; Power (Watts): 0.1W, 1/10W; Resistance (Sortable): 100000; Temperature Coefficient: ±100ppm/°C; Tolerance: ±1%; Datasheets: http://www.yageo.com/documents/recent/PYu-RC_Group_51_RoHS_L_9.pdf; Image: //media.digikey.com/Renders/Yageo%20Renders/0603-(1608-Metric).jpg; Operating Temperature: -55°C ~ 155°C
R4 = CMP-126-0400-1: RES SMD 150K OHM 1% 1/10W 0603; Manufacturer Part Number: RC0603FR-07150KL; Manufacturer: Yageo; Power (Watts): 0.1W, 1/10W; Resistance (Sortable): 150000; Temperature Coefficient: ±100ppm/°C; Tolerance: ±1%; Datasheets: http://www.yageo.com/documents/recent/PYu-RC_Group_51_RoHS_L_9.pdf; Image: //media.digikey.com/Renders/Yageo%20Renders/0603-(1608-Metric).jpg; Operating Temperature: -55°C ~ 155°C
R12 = CMP-126-0304-1: RES SMD 20K OHM 1% 1/10W 0603; Manufacturer Part Number: RC0603FR-0720KL; Manufacturer: Yageo; Resistance (Sortable): 20000; Power (Watts): 0.1W, 1/10W; Temperature Coefficient: ±100ppm/°C; Datasheets: http://www.yageo.com/documents/recent/PYu-RC_Group_51_RoHS_L_9.pdf; Image: //media.digikey.com/Renders/Yageo%20Renders/0603-(1608-Metric).jpg; Tolerance: ±1%; Operating Temperature: -55°C ~ 155°C
U1 = CMP-047-0013-1: BUCKBOOST TPS63070RNM, RNM0015A; Manufacturer: Texas Instruments; Manufacturer Part Number: TPS63070RNMR; Quiescent Current: 50uA; Min Input Voltage: 2V; Max Input Voltage: 16V; Output Current: 2A; Switching Frequency: 2.4MHz; Topology: Buck-Boost; Number of Outputs: 1; Min Output Voltage: 2.5V; Max Output Voltage: 9V; Synchronous Rectifier: Yes; Output Type: Adjustable; Output Configuration: Positive; ComponentLink1Description: Datasheet Link; ComponentLink1URL: https://sps06.itg.ti.com/sites/KMS/crossdivteams/altium/docs/ComponentDatasheets/TPS63070_datasheet_23_April2015.pdf; Stock 1: 16230; Pricing 1: 1=2.67, 10=2.402, 100=1.9306, 500=1.5862, 1000=1.31428 (USD); Mount: Surface Mount; Case/Package: VQFN; Number of Pins: 15; Min Operating Temperature: -40°C; Max Operating Temperature: 125°C; Packaging: Tape and Reel; Lead Free: Lead Free; Design Item ID: TPS63070RNM; Source: ic_pmic.SchLib

## Sheet Blink_Blink_Beep_Boop.SchDoc: External Indicators
size A4; SheetNumber: 5; SheetTotal: 6
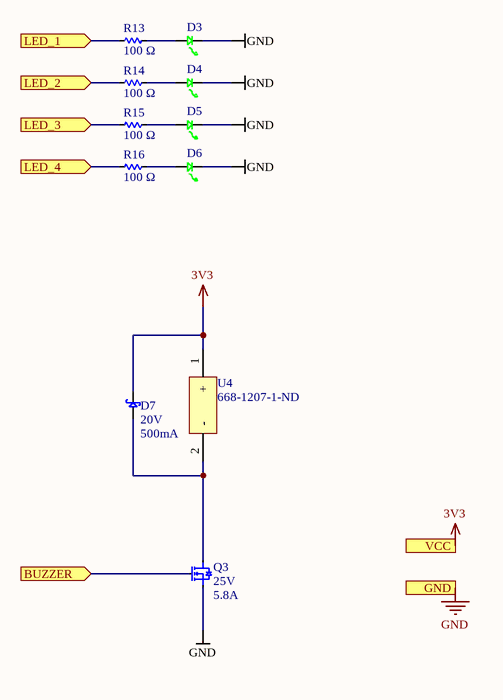
[diagram p3: Blink_Blink_Beep_Boop.SchDoc]

### Parts
D3  LED_LY971  [0805_Diode]  (value not drawn)
D4  LED_LY971  [0805_Diode]  (value not drawn)
D5  LED_LY971  [0805_Diode]  (value not drawn)
D6  LED_LY971  [0805_Diode]  (value not drawn)
D7  Voltage - DC Reverse (Vr) (Max): 20V  Current - Average Rectified (Io): 500mA  [SOD123]  (hidden comment: SCHOTTKY_MBR0520L)
Q3  Drain to Source Voltage (Vdss): 25V  Current - Continuous Drain (Id) @ 25° C: 5.8A  [3SOT23]  (hidden comment: MOSFET N-CH 60V 1.7A SSOT3)
R13  Resistance: 100 Ω  [R0603]  (hidden comment: __template_resistor)
R14  Resistance: 100 Ω  [R0603]  (hidden comment: __template_resistor)
R15  Resistance: 100 Ω  [R0603]  (hidden comment: __template_resistor)
R16  Resistance: 100 Ω  [R0603]  (hidden comment: __template_resistor)
U4  Supplier Part Number 1: 668-1207-1-ND  [BUZ_SMT-0540-T-7-R]  (hidden comment: BUZ_SMT-0540-T-7-R)

### Ports
BUZZER (in), GND (in), LED_1 (in), LED_2 (in), LED_3 (in), LED_4 (in), VCC (in)

### Nets
3V3: D7.2 U4.1(+) ; port VCC
GND: D3.1 D4.1 D5.1 D6.1 Q3.2 ; port GND
BUZZER: Q3.1 ; port BUZZER
LED_1: R13.1 ; port LED_1
LED_2: R14.1 ; port LED_2
LED_3: R15.1 ; port LED_3
LED_4: R16.1 ; port LED_4
NetD3_2: D3.2 R13.2
NetD4_2: D4.2 R14.2
NetD5_2: D5.2 R15.2
NetD6_2: D6.2 R16.2
NetD7_1: D7.1 Q3.3 U4.2(-)

### Notes on the sheet
- Title
- Size:
- Date:
- A4
- Number:
- Time:
- Revision:
- Sheet
- of
- File:

### Library data of the parts
D3-D6 = LED_LY971: LED 0805 GREEN 20MA; Manufacturer: OSRAM Opto Semiconductors Inc; Manufacturer Part Number: LG R971-KN-1; Wavelength - Dominant: 570nm; Wavelength - Peak: 572nm; Millicandela Rating: 26.05mcd; Voltage - Forward (Vf) (Typ): 2.2V; Viewing Angle: 160°; Lens Transparency: Diffused; Lens Color: White; Lens Style/Size: Rectangle with Flat Top, 1.30mm x 1.25mm; Supplier 1: Digi-Key; RoHS: RoHS Compliant; Category: Optoelectronics; Stock 1: 89733; Pricing 1: 1=0.08, 10=0.069, 100=0.0548, 250=0.04796, 500=0.04384 (USD); Packaging: Cut Tape (CT); Color: Green; Package / Case: 0805 (2012 Metric); Supplier Device Package: *; Size / Dimension: 2.00mm L x 1.25mm W; Height (Max): 0.80mm; Mounting Type: Surface Mount; ComponentLink1URL: http://www.osram-os.com/Graphics/XPic9/00078860_0.pdf; ComponentLink1Description: http://www.osram-os.com/Graphics/XPic9/00078860_0.pdf; Supplier Part Number 1: 475-1410-1-ND; Current - Test: 20mA
D7 = SCHOTTKY_MBR0520L: DIODE SCHOTTKY 0.5A 20V SOD-123; Manufacturer: Fairchild Semiconductor; Voltage - Forward (Vf) (Max) @ If: 385mV @ 500mA; Speed: Fast Recovery =< 500ns, > 200mA (Io); Current - Reverse Leakage @ Vr: 250µA @ 20V; Supplier 1: Digi-Key; Manufacturer Part Number: MBR0520L; RoHS: RoHS Compliant; Category: Discrete Semiconductor Products; Stock 1: 217232; Pricing 1: 1=0.63, 10=0.43, 100=0.2024, 250=0.1442, 500=0.11006, 750=0.08603, 1000=0.0759 (USD); Diode Type: Schottky; Reverse Recovery Time (trr): -; Capacitance @ Vr, F: -; Mounting Type: Surface Mount; Package / Case: SOD-123; Supplier Device Package: SOD-123; Packaging: Cut Tape (CT); ComponentLink1URL: http://www.fairchildsemi.com/ds/MB/MBR0520L.pdf; ComponentLink1Description: Datasheet; Supplier Part Number 1: MBR0520LCT-ND
Q3 = NFET_IRFML8244TRPBF: MOSFET N-CH 25V 5.8A SOT23; Manufacturer: International Rectifier; FET Type: MOSFET N-Channel, Metal Oxide; FET Feature: Logic Level Gate; Rds On (Max) @ Id, Vgs: 24 mOhm @ 5.8A, 10V; Vgs(th) (Max) @ Id: 2.35V @ 10µA; Gate Charge (Qg) @ Vgs: 5.4nC @ 10V; Input Capacitance (Ciss) @ Vds: 430pF @ 10V; Power - Max: 1.25W; Supplier 1: Digi-Key; Manufacturer Part Number: IRFML8244TRPBF; RoHS: RoHS Compliant; Category: Discrete Semiconductor Products; Stock 1: 13542; Pricing 1: 1=0.41, 10=0.23, 100=0.1491, 250=0.13548, 500=0.1219, 1000=0.11411 (USD); Mounting Type: Surface Mount; Package / Case: TO-236-3, SC-59, SOT-23-3; Supplier Device Package: SOT-23; Packaging: Cut Tape (CT); ComponentLink1URL: http://www.irf.com/product-info/datasheets/data/irfml8244pbf.pdf; ComponentLink1Description: Datasheet; Supplier Part Number 1: IRFML8244TRPBFCT-ND
R13-R16 = 311-100HRCT-ND: RES SMD 100 OHM 1% 1/10W 0603; Manufacturer Part Number: RC0603FR-07100RL; Manufacturer: Yageo; Power (Watts): 0.1W, 1/10W; Resistance (Sortable): 100; Temperature Coefficient: ±100ppm/°C; Tolerance: ±1%; Supplier 1: Digikey; Datasheets: http://www.yageo.com/documents/recent/PYu-RC_Group_51_RoHS_L_9.pdf; Image: //media.digikey.com/Renders/Yageo%20Renders/0603-(1608-Metric).jpg; Supplier Part Number 1: 311-100HRCT-ND; Operating Temperature: -55°C ~ 155°C
U4 = BUZ_SMT-0540-T-7-R: Peak-Peak Signal Buzzer Single Tone 4kHz Magnetic 2 ~ 4V 78dB @ 3V, 10cm; Manufacturer: PUI Audio, Inc.; Driver Circuitry: Transducer, Externally Driven; Voltage Range: 2 ~ 4V; Current - Supply: 100mA; Port Location: Top; Supplier 1: Digi-Key; Manufacturer Part Number: SMT-0540-T-7-R; RoHS: RoHS Compliant; Category: Audio Products; Stock 1: 12397; Pricing 1: 1=3.99, 10=3.325, 100=2.66, 500=2.3275 (USD); Packaging: Cut Tape (CT); Part Status: Active; Input Type: Peak-Peak Signal; Voltage - Rated: 3V; Frequency: 4kHz; Technology: Magnetic; Operating Mode: Single Tone; Duration: -; Sound Pressure Level: 78dB @ 3V, 10cm; Operating Temperature: -30°C ~ 70°C; Approvals: -; Ratings: -; Mounting Type: Surface Mount; Termination: Solder Pads; Size / Dimension: 5.0mm L x 5.0mm W x 2.1mm H; Height - Seated (Max): *; ComponentLink1URL: http://www.puiaudio.com/pdf/SMT-0540-T-7-R.pdf; ComponentLink1Description: http://www.puiaudio.com/pdf/SMT-0540-T-7-R.pdf

## Sheet SAMD51.SchDoc
size A4
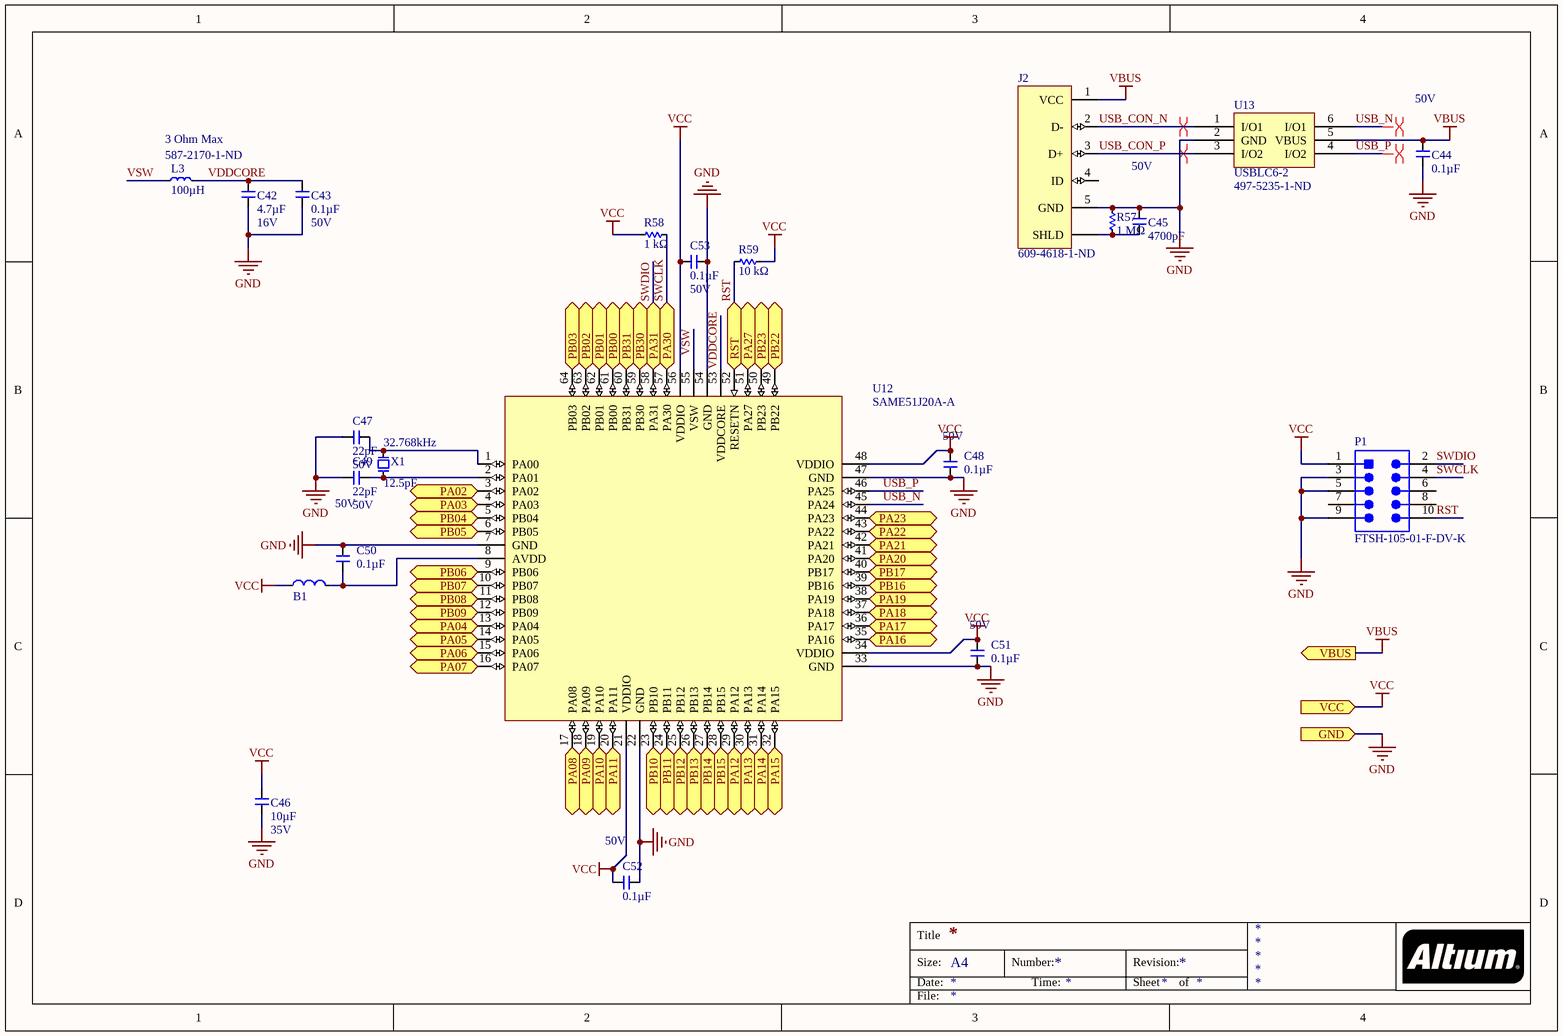
[diagram p4: SAMD51.SchDoc]

### Parts
B1  FB_1608  [R0603]  (value not drawn)
C42  Capacitance (shorthand): 4.7µF  Rated Voltage: 16V  [C0603]  (hidden comment: __template_cap)
C43  Capacitance (shorthand): 0.1µF  Rated Voltage: 50V  [C0603]  (hidden comment: __template_cap)
C44  Capacitance (shorthand): 0.1µF  Rated Voltage: 50V  [C0603]  (hidden comment: __template_cap)
C45  Capacitance (shorthand): 4700pF  Rated Voltage: 50V  [C0603]  (hidden comment: __template_cap)
C46  Capacitance (shorthand): 10µF  Rated Voltage: 35V  [C0603]  (hidden comment: __template_cap)
C47  Capacitance (shorthand): 22pF  Rated Voltage: 50V  [C0603]  (hidden comment: __template_cap)
C48  Capacitance (shorthand): 0.1µF  Rated Voltage: 50V  [C0603]  (hidden comment: __template_cap)
C49  Capacitance (shorthand): 22pF  Rated Voltage: 50V  [C0603]  (hidden comment: __template_cap)
C50  Capacitance (shorthand): 0.1µF  Rated Voltage: 50V  [C0603]  (hidden comment: __template_cap)
C51  Capacitance (shorthand): 0.1µF  Rated Voltage: 50V  [C0603]  (hidden comment: __template_cap)
C52  Capacitance (shorthand): 0.1µF  Rated Voltage: 50V  [C0603]  (hidden comment: __template_cap)
C53  Capacitance (shorthand): 0.1µF  Rated Voltage: 50V  [C0603]  (hidden comment: __template_cap)
J2  Supplier Part Number 1: 609-4618-1-ND  [CONN_USBMICROB_10118194-0001LF]  (hidden comment: CONN_USB_MICROB_SMD_TH_R/A)
L3  DC Resistance (DCR): 3 Ohm Max  Inductance: 100µH  Supplier Part Number 1: 587-2170-1-ND  [C1210]  (hidden comment: INDUCTOR 100UH 270MA 1210 SMD)
P1  FTSH-105-01-F-DV-K  [SMTC-FTSH-105-01-L-DV-K_V]
R57  Resistance: 1 MΩ  [R0603]  (hidden comment: __template_resistor)
R58  Resistance: 1 kΩ  [R0603]  (hidden comment: __template_resistor)
R59  Resistance: 10 kΩ  [R0603]  (hidden comment: __template_resistor)
U12  SAME51J20A-A  [SAMD TQFP-64]
U13  USBLC6-2  Supplier Part Number 1: 497-5235-1-ND  [6SOT23]
X1  Frequency: 32.768kHz  Load Capacitance: 12.5pF  [XTAL_TXC_9HT10]  (hidden comment: XTAL_9HT10-32.768KEZF-T)

### Ports
GND (in), PA02 (bidir), PA03 (bidir), PA04 (bidir), PA05 (bidir), PA06 (bidir), PA07 (bidir), PA08 (bidir), PA09 (bidir), PA10 (bidir), PA11 (bidir), PA12 (bidir), PA13 (bidir), PA14 (bidir), PA15 (bidir), PA16 (bidir), PA17 (bidir), PA18 (bidir), PA19 (bidir), PA20 (bidir), PA21 (bidir), PA22 (bidir), PA23 (bidir), PA27 (bidir), PA30 (bidir), PA31 (bidir), PB00 (bidir), PB01 (bidir), PB02 (bidir), PB03 (bidir), PB04 (bidir), PB05 (bidir), PB06 (bidir), PB07 (bidir), PB08 (bidir), PB09 (bidir), PB10 (bidir), PB11 (bidir), PB12 (bidir), PB13 (bidir), PB14 (bidir), PB15 (bidir), PB16 (bidir), PB17 (bidir), PB22 (bidir), PB23 (bidir), PB30 (bidir), PB31 (bidir), RST (bidir), VBUS (out), VCC (in)

### Nets
GND: C42.1 C43.2 C44.2 C45.1 C46.1 C47.1 C48.1 C49.1 C50.1 C51.1 C52.2 C53.1 J2.5(GND) P1.3 P1.5 P1.9 R57.2 U12.7(GND) U12.22(GND) U12.33(GND) U12.47(GND) U12.54(GND) U13.2(GND) ; port GND
VBACKUP: U12.64(PB03) ; port PB03
VBUS: C44.1 J2.1(VCC) U13.5(VBUS) ; port VBUS
VCC: B1.1 C46.2 C48.2 C51.2 C52.1 C53.2 P1.1 R58.2 R59.2 U12.21(VDDIO) U12.34(VDDIO) U12.48(VDDIO) U12.56(VDDIO) ; port VCC  [project net 3V3]
ACCEL_CS_1: U12.12(PB09) ; port PB09
ACCEL_CS_2: U12.6(PB05) ; port PB05
ACCEL_INT_1: U12.50(PB23) ; port PB23
ACCEL_INT_2: U12.39(PB16) ; port PB16
ADXL_CS_1: U12.9(PB06) ; port PB06
ADXL_CS_2: U12.3(PA02) ; port PA02
ADXL_INT_1: U12.49(PB22) ; port PB22
ADXL_INT_2: U12.31(PA14) ; port PA14
BAT_SNS_A: U12.63(PB02) ; port PB02
BMP_CS_1: U12.10(PB07) ; port PB07
BMP_CS_2: U12.4(PA03) ; port PA03
BUZZER: U12.32(PA15) ; port PA15
CAN_STBY_1: U12.41(PA20) ; port PA20
GYRO_CS_1: U12.11(PB08) ; port PB08
GYRO_CS_2: U12.5(PB04) ; port PB04
GYRO_INT_1: U12.51(PA27) ; port PA27
GYRO_INT_2: U12.40(PB17) ; port PB17
LED_3: U12.59(PB30) ; port PB30
LED_4: U12.60(PB31) ; port PB31
MISO: U12.13(PA04) ; port PA04
MOSI: U12.16(PA07) ; port PA07
RF_BUSY: U12.43(PA22) ; port PA22
RF_CS: U12.38(PA19) ; port PA19
RF_DIO1: U12.28(PB15) ; port PB15
RS485_TE: U12.27(PB14) ; port PB14
RST: P1.10 R59.1 U12.52(RESETN) ; port RST
SCK: U12.14(PA05) ; port PA05
SD_CD: U12.15(PA06) ; port PA06
SD_CLK: U12.24(PB11) ; port PB11
SD_CMD: U12.17(PA08) ; port PA08
SD_DAT0: U12.18(PA09) ; port PA09
SD_DAT1: U12.19(PA10) ; port PA10
SD_DAT2: U12.20(PA11) ; port PA11
SD_DAT3: U12.23(PB10) ; port PB10
SWCLK: P1.4 R58.1 U12.57(PA30) ; port PA30  [project net LED_1]
SWDIO: P1.2 U12.58(PA31) ; port PA31  [project net LED_2]
USB_CON_N: J2.2(D-) U13.1(I/O1)
USB_CON_P: J2.3(D+) U13.3(I/O2)
USB_N: U12.45(PA24) U13.6(I/O1)
USB_P: U12.46(PA25) U13.4(I/O2)
VDDCORE: C42.2 C43.1 L3.1 U12.53(VDDCORE)
VSW: L3.2 U12.55(VSW)
NetB1_2: B1.2 C50.2 U12.8(AVDD)
NetC45_2: C45.2 J2.SHIELD(SHLD) R57.1
NetC47_2: C47.2 U12.1(PA00) X1.2
NetC49_2: C49.2 U12.2(PA01) X1.1
NetCANA1_1: U12.26(PB13) ; port PB13
NetCANA1_4: U12.25(PB12) ; port PB12
NetR5_2: U12.62(PB01) ; port PB01
NetR6_1: U12.42(PA21) ; port PA21
NetR9_2: U12.61(PB00) ; port PB00
NetR10_1: U12.44(PA23) ; port PA23
NetU10_13: U12.30(PA13) ; port PA13
NetU10_14: U12.29(PA12) ; port PA12
NetU12_35: U12.35(PA16) ; port PA16
NetU12_36: U12.36(PA17) ; port PA17
NetU12_37: U12.37(PA18) ; port PA18

Not connected (* = marked no-connect by the designer): J2 4(ID); P1 6 7 8

### Layout directives
differential pair: USB_CON_N, USB_CON_P, USB_N, USB_P

### Notes on the sheet
- Title
- Size:
- Date:
- A4
- Number:
- Time:
- Revision:
- Sheet
- of
- File:

### Library data of the parts
B1 = FB_1608: FERRITE BEAD 600 OHM 300mA; Manufacturer: Taiyo Yuden; Manufacturer Part Number: BK1608HW601-T; Number of Lines: 1; Impedance @ Frequency: 600 Ohm @ 100MHz; DC Resistance (DCR) (Max): 400 mOhm; Supplier 1: Digi-Key; Supplier Part Number 1: 587-1879-1-ND; RoHS: RoHS Compliant; Category: Filters; Stock 1: 11908; Pricing 1: 1=0.1, 10=0.059, 50=0.0474, 100=0.0426, 250=0.0312, 500=0.0227, 1000=0.02223 (USD); Packaging: Cut Tape (CT); Part Status: Active; Filter Type: -; Current Rating (Max): 300mA; Ratings: -; Operating Temperature: -55°C ~ 125°C; Package / Case: 0603 (1608 Metric); Mounting Type: Surface Mount; Height (Max): 0.037" (0.95mm); Size / Dimension: 0.063" L x 0.031" W (1.60mm x 0.80mm); ComponentLink1URL: http://ds.yuden.co.jp/TYCOMPAS/ut/detail.do?productNo=BK1608HW601-T&fileName=BK1608HW601-T_SS&mode=specSheetDownload; ComponentLink1Description: http://ds.yuden.co.jp/TYCOMPAS/ut/detail.do?productNo=BK1608HW601-T&fileName=BK1608HW601-T_SS&mode=specSheetDownload
C42 = 311-1785-1-ND: CAP CER 4.7UF 16V X5R 0603 10%; Manufacturer: Yageo; Capacitance - pF (Machine readable): #NAME?; type: capacitor; Dielectric: X5R; Supplier 1: Digikey; Supplier Part Number 1: 311-1785-1-ND
C43 C44 C48 C50-C53 = 490-1519-1-ND: CAP CER 0603 0.1µF X7R 50V 10%; Manufacturer: Murata Electronics North America; Capacitance - pF (Machine readable): #NAME?; type: capacitor; Dielectric: X7R; Supplier 1: Digikey; Supplier Part Number 1: 490-1519-1-ND
C45 = 490-1506-1-ND: CAP CER 0603 4700pF X7R 50V 10%; Manufacturer: Murata Electronics North America; Capacitance - pF (Machine readable): #NAME?; type: capacitor; Dielectric: X7R; Supplier 1: Digikey; Supplier Part Number 1: 490-1506-1-ND
C46 = 490-13248-1-ND: CAP CER 10UF 35V X5R 0603 20%; Manufacturer: Murata Electronics North America; Capacitance - pF (Machine readable): #NAME?; type: capacitor; Dielectric: X5R; Supplier 1: Digikey; Supplier Part Number 1: 490-13248-1-ND
C47 C49 = 490-1411-1-ND: CAP CER 22PF 50V C0G/NP0 0603; Manufacturer: Murata Electronics North America; Capacitance - pF (Machine readable): 22; type: capacitor; Dielectric: C0G, NP0; Supplier 1: Digikey; Supplier Part Number 1: 490-1411-1-ND
J2 = CONN_USB_MICROB_SMD_TH_R/A: CONN RCPT USB2.0 MICRO B SMD R/A; Manufacturer: Amphenol FCI; Manufacturer Part Number: 10118194-0001LF; Gender: Receptacle; Current Rating: 1.8A; Connector Type: USB,Receptacle; Number of Contacts: 5; Insulation Resistance: 1GR; Number of Ports: 1; Max Voltage Rating (AC): 100V; Pitch: 0.65mm; Supplier 1: Digi-Key; Stock 1: 180464; Pricing 1: 1=0.46, 10=0.437, 25=0.3744, 50=0.318, 100=0.3056, 250=0.2744, 500=0.262 (USD); Mount: Surface Mount,Horizontal; Contact Material: Copper Alloy; Contact Plating: Nickel,Gold; Number of Terminals: 5; Housing Material: Polymer; Colour: Black; Min Operating Temperature: -55°C; Max Operating Temperature: 85°C; Package Quantity: 9600; Packaging: Tape and Reel; Termination: Solder; Orientation: Right Angle; Length: 8.05mm; Depth: 5mm; Radiation Hardening: No; Lead Free: Lead Free; Flammability Rating: UL94 V-0; ComponentLink1URL: https://datasheet.ciiva.com/851/10118194-851110.pdf; ComponentLink1Description: https://datasheet.ciiva.com/851/10118194-851110.pdf; ComponentLink2URL: https://datasheet.ciiva.com/851/10118194-851111.pdf; ComponentLink2Description: https://datasheet.ciiva.com/851/10118194-851111.pdf; ComponentLink3URL: https://datasheet.ciiva.com/4598/10118194ac-197217-4598807.pdf; ComponentLink3Description: https://datasheet.ciiva.com/4598/10118194ac-197217-4598807.pdf; ComponentLink4URL: https://datasheet.ciiva.com/29907/10118194-29907230.pdf; ComponentLink4Description: https://datasheet.ciiva.com/29907/10118194-29907230.pdf; ComponentLink5URL: https://datasheet.ciiva.com/26945/getdatasheetpartid-418619-26945695.pdf; ComponentLink5Description: https://datasheet.ciiva.com/26945/getdatasheetpartid-418619-26945695.pdf
L3 = IND_BRL3225T101K: Manufacturer: Taiyo Yuden; Current - Temperature Rise: 250mA; Tolerance: ±10%; Shielding: Unshielded; Frequency - Self Resonant: 5MHz; Frequency - Test: 100kHz; Manufacturer Part Number: BRL3225T101K; RoHS: RoHS Compliant; Category: Inductors, Coils, Chokes; Current - Saturation: 270mA; Type: -; Q @ Freq: -; Applications: Power Supplies; Material - Core: -; Package / Case: 1210 (3225 Metric); Mounting Type: Surface Mount; Packaging: Cut Tape (CT); Operating Temperature: -40°C ~ 105°C; ComponentLink1URL: http://www.yuden.co.jp/ut/product/pdf/wound07_e.pdf; ComponentLink1Description: Datasheet; Current: 270mA; Supplier 1: Digi-Key; Stock 1: 84687; Pricing 1: 1=0.16, 10=0.155, 50=0.145, 100=0.1354, 500=0.10638, 1000=0.08704 (GBP)
P1 = CMP-2000-05352-1: Male Header, Pitch 1.27 mm, 2 x 5 Position, Height 6.12 mm, RoHS, Tube; Manufacturer: Samtec; Number of Positions: 10; Connector Type: Header,Shrouded; Number of Positions Loaded: All; Row Spacing: 0.050"(1.27mm); Fastening Type: -; Package Reference: FTSH-105-01-L-DV-K; Termination: Solder; Package URL: http://suddendocs.samtec.com/prints/ftsh-1xx-xx-xxx-dv-xxx-footprint.pdf; Number of Rows: 2; Contact Finish Thickness: 3µin(0.08µm); Contact Type: MalePin; Manufacturer URL: http://www.samtec.com/; Series: FTSH; Features: -; Contact Finish: Gold; Color: Black; Family: RectangularConnectors-Headers,MalePins; Datasheet URL: http://suddendocs.samtec.com/prints/ftsh-1xx-xx-xxx-dv-xxx-mkt.pdf; Package Description: Male Header, Pitch 1.27 mm, 2 x 5 Position, Height 5.97 mm, Tail Length 4.32 mm; Mounting Type: SurfaceMount; Datasheet Version: Rev. ET, 10/1995; Category: Connectors,Interconnects; Packaging: Tube; Contact Mating Length: 0.120"(3.05mm); Pitch: 0.050"(1.27mm)
R57 = 311-1.00MHRCT-ND: RES SMD 1M OHM 1% 1/10W 0603; Manufacturer Part Number: RC0603FR-071ML; Manufacturer: Yageo; Resistance (Sortable): 1000000; Power (Watts): 0.1W, 1/10W; Temperature Coefficient: ±100ppm/°C; Supplier 1: Digikey; Datasheets: http://www.yageo.com/documents/recent/PYu-RC_Group_51_RoHS_L_9.pdf; Image: //media.digikey.com/Renders/Yageo%20Renders/0603-(1608-Metric).jpg; Supplier Part Number 1: 311-1.00MHRCT-ND; Tolerance: ±1%; Operating Temperature: -55°C ~ 155°C
R58 = 311-1.00KHRCT-ND: RES SMD 1K OHM 1% 1/10W 0603; Manufacturer Part Number: RC0603FR-071KL; Manufacturer: Yageo; Resistance (Sortable): 1000; Power (Watts): 0.1W, 1/10W; Temperature Coefficient: ±100ppm/°C; Supplier 1: Digikey; Datasheets: http://www.yageo.com/documents/recent/PYu-RC_Group_51_RoHS_L_9.pdf; Image: //media.digikey.com/Renders/Yageo%20Renders/0603-(1608-Metric).jpg; Supplier Part Number 1: 311-1.00KHRCT-ND; Tolerance: ±1%; Operating Temperature: -55°C ~ 155°C
R59 = 311-10.0KHRCT-ND: RES SMD 10K OHM 1% 1/10W 0603; Manufacturer Part Number: RC0603FR-0710KL; Manufacturer: Yageo; Resistance (Sortable): 10000; Power (Watts): 0.1W, 1/10W; Temperature Coefficient: ±100ppm/°C; Supplier 1: Digikey; Datasheets: http://www.yageo.com/documents/recent/PYu-RC_Group_51_RoHS_L_9.pdf; Image: //media.digikey.com/Renders/Yageo%20Renders/0603-(1608-Metric).jpg; Supplier Part Number 1: 311-10.0KHRCT-ND; Tolerance: ±1%; Operating Temperature: -55°C ~ 155°C
U12 = SAME51J20A-A: Atmel SAM ARM Cortex M4; ComponentLink1Description: Product Page; ComponentLink1URL: https://www.microchip.com/wwwproducts/en/ATSAMD21G18; ComponentLink2Description: Datasheet; ComponentLink2URL: http://ww1.microchip.com/downloads/en/DeviceDoc/SAM-D21-Family-Datasheet-DS40001882C.pdf
U13 = USBLC6-2: Manufacturer: STMicroelectronics; Manufacturer Part Number: USBLC6-2SC6; Unidirectional Channels: 2; Voltage - Reverse Standoff (Typ): 5.25V; Voltage - Breakdown (Min): 6V; Voltage - Clamping (Max) @ Ipp: 17V; Current - Peak Pulse (10/1000µs): 5A (8/20µs); Power Line Protection: Yes; Supplier 1: Digi-Key; RoHS: RoHS Compliant; Category: Circuit Protection; Stock 1: 31719; Pricing 1: 1=0.51, 10=0.411, 100=0.2802, 500=0.21012, 1000=0.15759 (USD); Packaging: Cut Tape (CT); Part Status: Active; Type: Steering (Rail to Rail); Bidirectional Channels: -; Power - Peak Pulse: -; Applications: Ethernet; Capacitance @ Frequency: -; Operating Temperature: -40°C ~ 125°C (TJ); Mounting Type: Surface Mount; Package / Case: SOT-23-6; Supplier Device Package: SOT-23-6; ComponentLink1URL: http://www.st.com/web/en/resource/technical/document/datasheet/CD00050750.pdf; ComponentLink1Description: http://www.st.com/web/en/resource/technical/document/datasheet/CD00050750.pdf
X1 = XTAL_9HT10-32.768KEZF-T: CRYSTAL 32.768 KHZ 12.5 PF SMD; Manufacturer: TXC CORPORATION; Frequency Tolerance: ±10ppm; ESR (Equivalent Series Resistance): 70 kOhm; Operating Mode: Fundamental; Supplier 1: Digi-Key; Manufacturer Part Number: 9HT10-32.768KEZF-T; RoHS: RoHS Compliant; Category: Crystals and Oscillators; Stock 1: 5250; Pricing 1: 1=1.88, 10=1.625, 50=1.425, 100=1.125, 500=0.95, 1000=0.75 (USD); Type: kHz Crystal (Tuning Fork); Frequency Stability: -; Operating Temperature: -40°C ~ 85°C; Ratings: -; Mounting Type: Surface Mount; Package / Case: 2-SMD; Size / Dimension: 0.126" L x 0.059" W (3.20mm x 1.50mm); Height: 0.033" (0.85mm); Packaging: Cut Tape (CT); ComponentLink1URL: http://www.txccrystal.com/images/pdf/9ht10.pdf; ComponentLink1Description: Datasheet; Supplier Part Number 1: 887-1507-1-ND

## Sheet SD.SchDoc
size A4
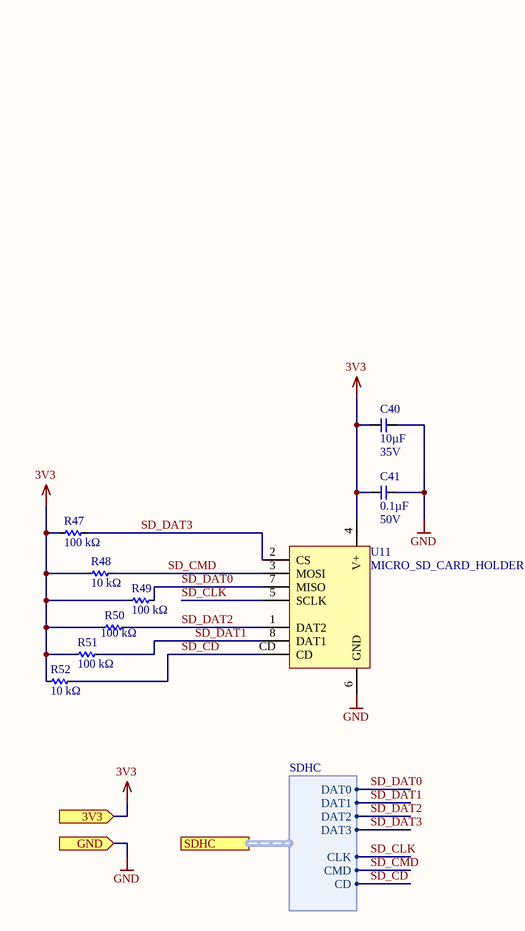
[diagram p5: SD.SchDoc]

### Parts
C40  Capacitance (shorthand): 10µF  Rated Voltage: 35V  [C0603]  (hidden comment: 490-13248-1-ND)
C41  Capacitance (shorthand): 0.1µF  Rated Voltage: 50V  [C0603]  (hidden comment: 490-1519-1-ND)
R47  Resistance: 100 kΩ  [R0603]  (hidden comment: 311-100KHRCT-ND)
R48  Resistance: 10 kΩ  [R0603]  (hidden comment: 311-10.0KHRCT-ND)
R49  Resistance: 100 kΩ  [R0603]  (hidden comment: 311-100KHRCT-ND)
R50  Resistance: 100 kΩ  [R0603]  (hidden comment: 311-100KHRCT-ND)
R51  Resistance: 100 kΩ  [R0603]  (hidden comment: 311-100KHRCT-ND)
R52  Resistance: 10 kΩ  [R0603]  (hidden comment: 311-10.0KHRCT-ND)
U11  MICRO_SD_CARD_HOLDER  [MICROSD_CARD_SOCKET]

### Ports
3V3 (in), GND (in), SDHC (harness SDHC)

### Harnesses
SDHC: DAT3, DAT0, DAT2, DAT1, CLK, CMD, CD

### Nets
3V3: C40.2 C41.1 R47.1 R48.1 R49.1 R50.1 R51.1 R52.1 U11.4(V+) ; port 3V3
GND: C40.1 C41.2 U11.6(GND) ; port GND
SD_CD: R52.2 U11.CD ; port SDHC.CD
SD_CLK: U11.5(SCLK) ; port SDHC.CLK
SD_CMD: R48.2 U11.3(MOSI) ; port SDHC.CMD
SD_DAT0: R49.2 U11.7(MISO) ; port SDHC.DAT0
SD_DAT1: R51.2 U11.8(DAT1) ; port SDHC.DAT1
SD_DAT2: R50.2 U11.1(DAT2) ; port SDHC.DAT2
SD_DAT3: R47.2 U11.2(CS) ; port SDHC.DAT3

### Notes on the sheet
- Title
- Size:
- Date:
- A4
- Number:
- Time:
- Revision:
- Sheet
- of
- File:

### Library data of the parts
C40 = CMP-119-0071-1: as C8 on sheet Sensors; Dielectric: X5R
C41 = CMP-119-0065-1: as C9 on sheet Sensors; Dielectric: X7R
R47 R49-R51 = CMP-126-0382-1: RES SMD 100K OHM 1% 1/10W 0603; Manufacturer Part Number: RC0603FR-07100KL; Manufacturer: Yageo; Resistance (Sortable): 100000; Power (Watts): 0.1W, 1/10W; Temperature Coefficient: ±100ppm/°C; Datasheets: http://www.yageo.com/documents/recent/PYu-RC_Group_51_RoHS_L_9.pdf; Image: //media.digikey.com/Renders/Yageo%20Renders/0603-(1608-Metric).jpg; Tolerance: ±1%; Operating Temperature: -55°C ~ 155°C
R48 R52 = CMP-126-0273-1: as R1 on sheet Battery_Management; Datasheets: http://www.yageo.com/documents/recent/PYu-RC_Group_51_RoHS_L_9.pdf; Image: //media.digikey.com/Renders/Yageo%20Renders/0603-(1608-Metric).jpg; Tolerance: ±1%; Operating Temperature: -55°C ~ 155°C
U11 = CMP-030-0037-1: MICROSD CARD HOLDER, PUSH-PUSH; Manufacturer: 3M; Manufacturer Part Number: 2908-05WB-MG; Card Type: Secure Digital - microSD™; Number of Positions: 10 (8 + 2); Connector Type: Connector and Ejector; Insertion, Removal Method: Push In, Push Out; RoHS: RoHS Compliant; Stock 1: 32313; Pricing 1: 1=3.6, 10=3.458, 25=3.1704, 50=3.0262, 100=2.882, 250=2.52176, 500=2.4497, 1000=2.08945 (USD); Packaging: Cut Tape (CT); Ejector Side: -; Mounting Type: Surface Mount, Right Angle; Features: Switch; Height Above Board: 0.073" (1.85mm); Mounting Feature: Normal, Standard - Top; Contact Finish: Gold; Contact Finish Thickness: 15µin (0.38µm); ComponentLink1URL: http://multimedia.3m.com/mws/media/416257O/3mtm-card-connector-microsdtm-2900-series-ts2197.pdf; ComponentLink1Description: http://multimedia.3m.com/mws/media/416257O/3mtm-card-connector-microsdtm-2900-series-ts2197.pdf; Design Item ID: MICRO_SD_CARD_HOLDER; Source: connector.SchLib